# Altium schematic sheet STM8.SchDoc
size A4
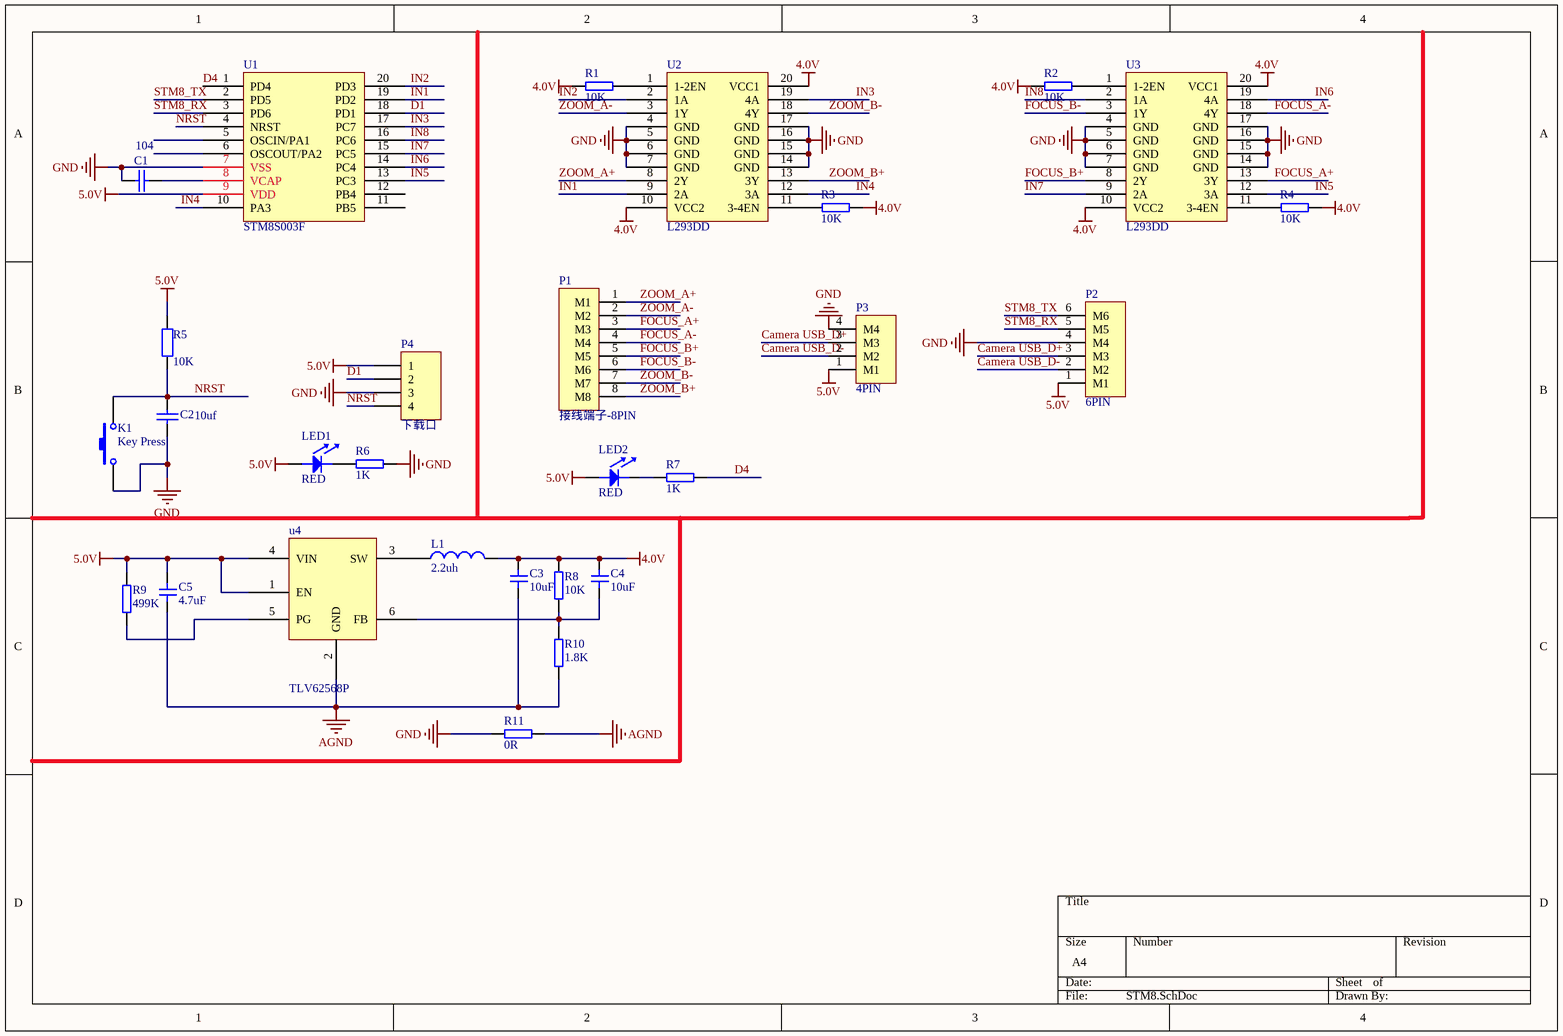
[diagram p0: STM8.SchDoc]

## Parts
C1  104  [0805c]
C2  value 10uf  [0805c]  (hidden comment: 104)
C3  10uF  [0805C]
C4  10uF  [0805C]
C5  4.7uF  [0805C]
K1  Key Press  [贴片按键]
L1  2.2uh  [电感（220uh）]
LED1  RED  [0805LED]
LED2  RED  [0805LED]
P1  接线端子-8PIN  [MX1.25MM-8P]
P2  6PIN  [XH2.54-6P]
P3  4PIN  [XH4/2.54mm/180]
P4  下载口  [Header 4]
R1  10K  [0805R]
R2  10K  [0805R]
R3  10K  [0805R]
R4  10K  [0805R]
R5  10K  [0805R]
R6  1K  [0805R]
R7  1K  [0805R]
R8  10K  [0805R]
R9  499K  [0805R]
R10  1.8K  [0805R]
R11  0R  [0805R]
U1  STM8S003F  [STM8_SOP20]
U2  L293DD  [SOP-20M]
U3  L293DD  [SOP-20M]
u4  TLV62568P  [TSOT23-6]

## Nets
4.0V: C3.2 C4.2 L1.2 R1.2 R2.2 R3.1 R4.1 R8.2 U2.10(VCC2) U2.20(VCC1) U3.10(VCC2) U3.20(VCC1)
5.0V: C5.2 LED1.1 LED2.1 P2.1(M1) P3.1(M1) P4.1 R5.2 R9.2 U1.9(VDD) u4.1(EN) u4.4(VIN)
AGND: C3.1 C5.1 R10.1 R11.2 u4.2(GND)
GND: C1.1 C2.1 K1.1 P2.4(M4) P3.4(M4) P4.3 R6.2 R11.1 U1.7(VSS) U2.4(GND) U2.5(GND) U2.6(GND) U2.7(GND) U2.14(GND) U2.15(GND) U2.16(GND) U2.17(GND) U3.4(GND) U3.5(GND) U3.6(GND) U3.7(GND) U3.14(GND) U3.15(GND) U3.16(GND) U3.17(GND)
Camera USB_D+: P2.3(M3) P3.3(M3)
Camera USB_D-: P2.2(M2) P3.2(M2)
D1: P4.2 U1.18(PD1)
D4: R7.2 U1.1(PD4)
FOCUS_A+: P1.3(M3) U3.13(3Y)
FOCUS_A-: P1.4(M4) U3.18(4Y)
FOCUS_B+: P1.5(M5) U3.8(2Y)
FOCUS_B-: P1.6(M6) U3.3(1Y)
IN1: U1.19(PD2) U2.9(2A)
IN2: U1.20(PD3) U2.2(1A)
IN3: U1.17(PC7) U2.19(4A)
IN4: U1.10(PA3) U2.12(3A)
IN5: U1.13(PC3) U3.12(3A)
IN6: U1.14(PC4) U3.19(4A)
IN7: U1.15(PC5) U3.9(2A)
IN8: U1.16(PC6) U3.2(1A)
NRST: C2.2 K1.2 P4.4 R5.1 U1.4(NRST)
STM8_RX: P2.5(M5) U1.3(PD6)
STM8_TX: P2.6(M6) U1.2(PD5)
ZOOM_A+: P1.1(M1) U2.8(2Y)
ZOOM_A-: P1.2(M2) U2.3(1Y)
ZOOM_B+: P1.8(M8) U2.13(3Y)
ZOOM_B-: P1.7(M7) U2.18(4Y)
NetC1_2: C1.2 U1.8(VCAP)
NetC4_1: C4.1 R8.1 R10.2 u4.6(FB)
NetL1_1: L1.1 u4.3(SW)
NetLED1_2: LED1.2 R6.1
NetLED2_2: LED2.2 R7.1
NetR1_1: R1.1 U2.1(1-2EN)
NetR2_1: R2.1 U3.1(1-2EN)
NetR3_2: R3.2 U2.11(3-4EN)
NetR4_2: R4.2 U3.11(3-4EN)
NetR9_1: R9.1 u4.5(PG)

Not connected (* = marked no-connect by the designer): U1 5(OSCIN/PA1) 6(OSCOUT/PA2) 11(PB5) 12(PB4)

## Library data of the parts
C1 C2 = Cap Semi: Capacitor (Semiconductor SIM Model); Published: 8-Jun-2000; LatestRevisionDate: 29-May-2009; LatestRevisionNote: IPC-7351 Footprint Added.; PackageReference: C1206; Publisher: Altium Limited; PackageDescription: Chip Capacitor
  C1: Value: 104
C3-C5 = Cap1: 无极贴片电容
K1 = K_Press: 贴片按键
L1 = 电感 220uh: 7*7*4
LED1 LED2 = LED: 发光二极管
P2 = 接线端子-6PIN
P3 = 接线端子-4PIN
P4 = Header 4: Header, 4-Pin; LatestRevisionDate: 17-Jul-2002; LatestRevisionNote: Re-released for DXP Platform.; Publisher: Altium Limited
R1-R4 R6-R11 = Res: 电阻
R5 = Res2: Resistor; Published: 8-Jun-2000; LatestRevisionDate: 17-Jul-2002; LatestRevisionNote: Re-released for DXP Platform.; PackageReference: AXIAL-0.4; Publisher: Altium Limited; PackageDescription: Axial Device, Thru-Hole; 2 Leads; 0.4 in Pin Spacing; Value: 10K
U1 = Component_1
U2 U3 = L293D